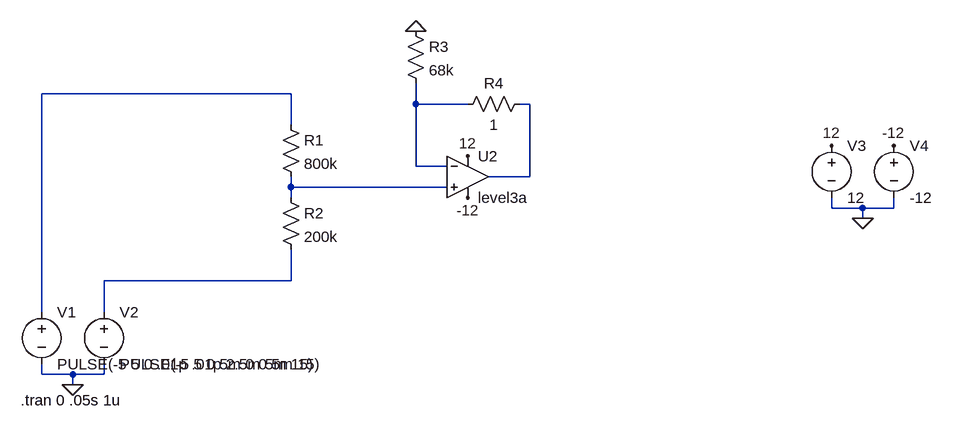
[diagram p0: schematic wave blend.asc]
wave blend.asc, the LTspice schematic file:
Version 4
SHEET 1 1396 680
WIRE 400 -272 16 -272
WIRE 592 -256 592 -288
WIRE 672 -256 592 -256
WIRE 768 -256 752 -256
WIRE 400 -224 400 -272
WIRE 592 -160 592 -256
WIRE 640 -160 592 -160
WIRE 768 -144 768 -256
WIRE 768 -144 704 -144
WIRE 400 -128 400 -144
WIRE 640 -128 400 -128
WIRE 400 -112 400 -128
WIRE 1232 -96 1232 -112
WIRE 1280 -96 1232 -96
WIRE 1328 -96 1328 -112
WIRE 1328 -96 1280 -96
WIRE 1280 -80 1280 -96
WIRE 400 16 400 -32
WIRE 400 16 112 16
WIRE 16 64 16 -272
WIRE 112 64 112 16
WIRE 16 160 16 144
WIRE 64 160 16 160
WIRE 112 160 112 144
WIRE 112 160 64 160
WIRE 64 176 64 160
FLAG 64 176 0
FLAG 1280 -80 0
FLAG 1232 -192 12
FLAG 1328 -192 -12
FLAG 672 -176 12
FLAG 672 -112 -12
FLAG 592 -368 0
SYMBOL voltage 16 48 R0
WINDOW 123 0 0 Left 0
WINDOW 39 0 0 Left 0
SYMATTR InstName V1
SYMATTR Value PULSE(-5 5 0 .01p .01p 2.5m 5m 15)
SYMBOL voltage 112 48 R0
WINDOW 123 0 0 Left 0
WINDOW 39 0 0 Left 0
SYMATTR InstName V2
SYMATTR Value PULSE(-5 5 0 5m 0 0 5m 15)
SYMBOL res 384 -240 R0
SYMATTR InstName R1
SYMATTR Value 800k
SYMBOL res 384 -128 R0
SYMATTR InstName R2
SYMATTR Value 200k
SYMBOL voltage 1232 -208 R0
WINDOW 123 0 0 Left 0
WINDOW 39 0 0 Left 0
SYMATTR InstName V3
SYMATTR Value 12
SYMBOL voltage 1328 -208 R0
WINDOW 123 0 0 Left 0
WINDOW 39 0 0 Left 0
SYMATTR InstName V4
SYMATTR Value -12
SYMBOL OpAmps\\UniversalOpAmp3 672 -144 R0
SYMATTR InstName U2
SYMBOL res 576 -384 R0
SYMATTR InstName R3
SYMATTR Value 68k
SYMBOL res 768 -272 R90
WINDOW 0 0 56 VBottom 2
WINDOW 3 32 56 VTop 2
SYMATTR InstName R4
SYMATTR Value 1
TEXT -16 200 Left 2 !.tran 0 .05s 1u

The netlist it stands for:
* wave blend.asc
V1 N001 0 PULSE(-5 5 0 .01p .01p 2.5m 5m 15)
V2 N005 0 PULSE(-5 5 0 5m 0 0 5m 15)
R1 N001 N004 800k
R2 N004 N005 200k
V3 12 0 12
V4 -12 0 -12
XU2 N004 N002 12 -12 N003 level3a  ; pins In+ In- V+ V- OUT
R3 0 N002 68k
R4 N003 N002 1
.tran 0 .05s 1u
.backanno
.end